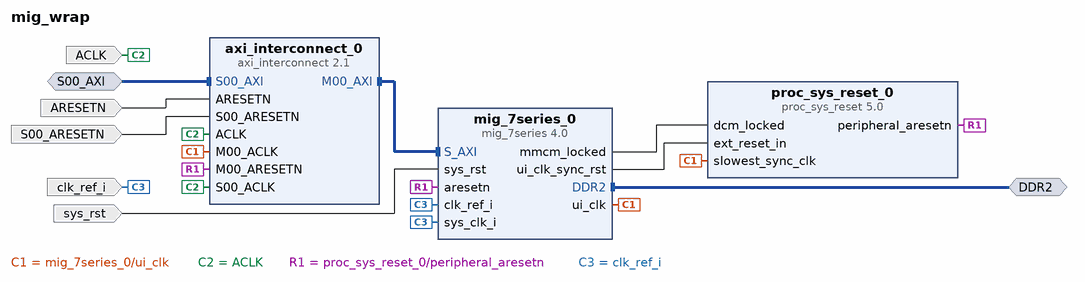
[diagram p0: block diagram of the top level]
# Vivado block design mig_wrap, xc7a100tcsg324-1, Vivado 2017.4
create_bd_design mig_wrap

create_bd_intf_port -mode Master -vlnv xilinx.com:interface:ddrx_rtl:1.0 DDR2
create_bd_intf_port -mode Slave -vlnv xilinx.com:interface:aximm_rtl:1.0 S00_AXI
set_property -dict [list \
  CONFIG.DATA_WIDTH 32 \
  CONFIG.PROTOCOL AXI4 \
  CONFIG.FREQ_HZ 50000000 \
  CONFIG.ID_WIDTH 4 \
  CONFIG.ADDR_WIDTH 32 \
  CONFIG.AWUSER_WIDTH 0 \
  CONFIG.ARUSER_WIDTH 0 \
  CONFIG.WUSER_WIDTH 0 \
  CONFIG.RUSER_WIDTH 0 \
  CONFIG.BUSER_WIDTH 0 \
  CONFIG.READ_WRITE_MODE READ_WRITE \
  CONFIG.HAS_BURST 1 \
  CONFIG.HAS_LOCK 1 \
  CONFIG.HAS_PROT 1 \
  CONFIG.HAS_CACHE 1 \
  CONFIG.HAS_QOS 1 \
  CONFIG.HAS_REGION 0 \
  CONFIG.HAS_WSTRB 1 \
  CONFIG.HAS_BRESP 1 \
  CONFIG.HAS_RRESP 1 \
  CONFIG.SUPPORTS_NARROW_BURST 1 \
  CONFIG.NUM_READ_OUTSTANDING 8 \
  CONFIG.NUM_WRITE_OUTSTANDING 8 \
  CONFIG.MAX_BURST_LENGTH 256 \
  CONFIG.NUM_READ_THREADS 1 \
  CONFIG.NUM_WRITE_THREADS 1 \
  CONFIG.RUSER_BITS_PER_BYTE 0 \
  CONFIG.WUSER_BITS_PER_BYTE 0 \
] [get_bd_intf_ports S00_AXI]
create_bd_port -dir I -type clk ACLK
set_property -dict [list \
  CONFIG.FREQ_HZ 50000000 \
  CONFIG.ASSOCIATED_BUSIF S00_AXI \
  CONFIG.ASSOCIATED_RESET ARESETN:S00_ARESETN \
] [get_bd_ports ACLK]
create_bd_port -dir I -type rst ARESETN
create_bd_port -dir I -type rst S00_ARESETN
create_bd_port -dir I -type rst sys_rst
create_bd_port -dir I -type clk clk_ref_i
set_property -dict [list \
  CONFIG.FREQ_HZ 200000000 \
  CONFIG.PHASE 0 \
  CONFIG.CLK_DOMAIN mig_wrap_mig_7series_0_0_ui_clk \
] [get_bd_ports clk_ref_i]

create_bd_cell -type ip -vlnv xilinx.com:ip:axi_interconnect:2.1 axi_interconnect_0
set_property -dict {CONFIG.NUM_MI 1 CONFIG.SYNCHRONIZATION_STAGES 2} [get_bd_cells axi_interconnect_0]
create_bd_cell -type ip -vlnv xilinx.com:ip:mig_7series:4.0 mig_7series_0
set_property -dict [list \
  CONFIG.XML_INPUT_FILE mig_a.prj \
  CONFIG.RESET_BOARD_INTERFACE Custom \
  CONFIG.MIG_DONT_TOUCH_PARAM Custom \
  CONFIG.BOARD_MIG_PARAM Custom \
] [get_bd_cells mig_7series_0]
create_bd_cell -type ip -vlnv xilinx.com:ip:proc_sys_reset:5.0 proc_sys_reset_0

# ---- connections ----

connect_bd_intf_net [get_bd_intf_pins axi_interconnect_0/M00_AXI] [get_bd_intf_pins mig_7series_0/S_AXI]
connect_bd_intf_net [get_bd_intf_ports DDR2] [get_bd_intf_pins mig_7series_0/DDR2]
connect_bd_intf_net [get_bd_intf_ports S00_AXI] [get_bd_intf_pins axi_interconnect_0/S00_AXI]
connect_bd_net [get_bd_pins mig_7series_0/ui_clk] [get_bd_pins axi_interconnect_0/M00_ACLK] [get_bd_pins proc_sys_reset_0/slowest_sync_clk]
connect_bd_net [get_bd_ports ACLK] [get_bd_pins axi_interconnect_0/ACLK] [get_bd_pins axi_interconnect_0/S00_ACLK]
connect_bd_net [get_bd_pins mig_7series_0/mmcm_locked] [get_bd_pins proc_sys_reset_0/dcm_locked]
connect_bd_net [get_bd_pins mig_7series_0/ui_clk_sync_rst] [get_bd_pins proc_sys_reset_0/ext_reset_in]
connect_bd_net [get_bd_pins proc_sys_reset_0/peripheral_aresetn] [get_bd_pins axi_interconnect_0/M00_ARESETN] [get_bd_pins mig_7series_0/aresetn]
connect_bd_net [get_bd_ports ARESETN] [get_bd_pins axi_interconnect_0/ARESETN]
connect_bd_net [get_bd_ports S00_ARESETN] [get_bd_pins axi_interconnect_0/S00_ARESETN]
connect_bd_net [get_bd_ports sys_rst] [get_bd_pins mig_7series_0/sys_rst]
connect_bd_net [get_bd_ports clk_ref_i] [get_bd_pins mig_7series_0/clk_ref_i] [get_bd_pins mig_7series_0/sys_clk_i]

# ---- address map ----
assign_bd_address -offset 0x01000000 -range 16M -target_address_space [get_bd_addr_spaces S00_AXI] [get_bd_addr_segs mig_7series_0/memmap/memaddr]

validate_bd_design
save_bd_design
